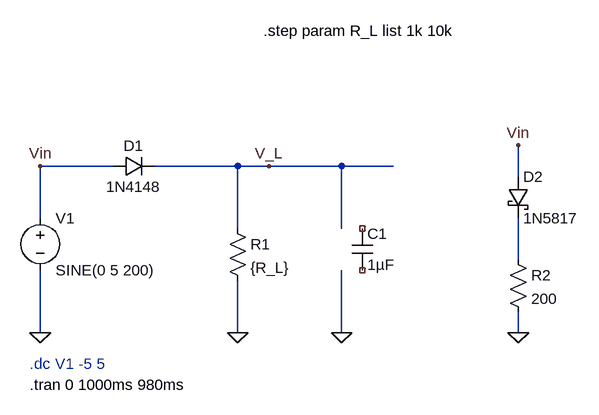
[diagram p0: schematic lab1part2.asc]
lab1part2.asc, the LTspice schematic file:
Version 4
SHEET 1 904 680
WIRE 176 48 64 48
WIRE 368 48 240 48
WIRE 416 48 368 48
WIRE 528 48 416 48
WIRE 608 48 528 48
WIRE 800 64 800 16
WIRE 64 128 64 48
WIRE 368 144 368 48
WIRE 528 144 528 48
WIRE 800 192 800 128
WIRE 64 304 64 208
WIRE 368 304 368 224
WIRE 528 304 528 208
WIRE 800 304 800 272
FLAG 64 304 0
FLAG 64 48 Vin
FLAG 368 304 0
FLAG 800 16 Vin
FLAG 800 304 0
FLAG 416 48 V_L
FLAG 528 304 0
SYMBOL voltage 64 112 R0
WINDOW 123 0 0 Left 0
WINDOW 39 0 0 Left 0
SYMATTR InstName V1
SYMATTR Value SINE(0 5 200)
SYMBOL res 352 128 R0
SYMATTR InstName R1
SYMATTR Value {R_L}
SYMBOL diode 176 64 R270
WINDOW 0 32 32 VTop 2
WINDOW 3 0 32 VBottom 2
SYMATTR InstName D1
SYMATTR Value 1N4148
SYMBOL res 784 176 R0
SYMATTR InstName R2
SYMATTR Value 200
SYMBOL schottky 784 64 R0
SYMATTR InstName D2
SYMATTR Value 1N5817
SYMATTR Description Diode
SYMATTR Type diode
SYMBOL cap 544 144 R0
SYMATTR InstName C1
SYMATTR Value 1µF
TEXT 48 352 Left 2 ;.dc V1 -5 5
TEXT 48 384 Left 2 !.tran 0 1000ms 980ms
TEXT 408 -160 Left 2 !.step param R_L list 1k 10k

The netlist it stands for:
* lab1part2.asc
V1 Vin 0 SINE(0 5 200)
R1 V_L 0 {R_L}
D1 Vin V_L 1N4148
R2 N001 0 200
D2 Vin N001 1N5817
C1 NC_01 NC_02 1µF
.model D D
.lib standard.dio
* .dc V1 -5 5
.tran 0 1000ms 980ms
.step param R_L list 1k 10k
.backanno
.end

* Results of the author's LTspice run, read from the files saved beside the schematic
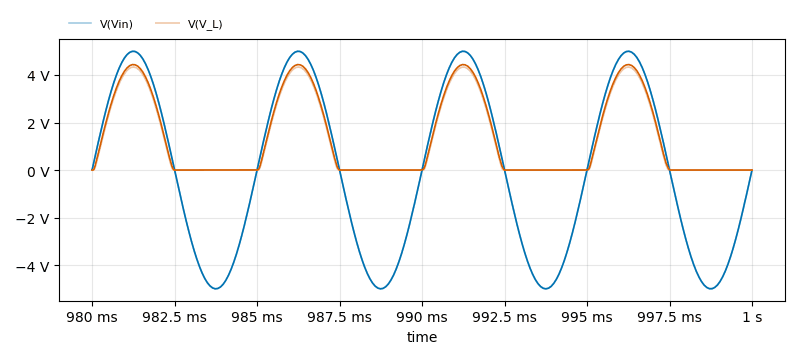
[diagram p1: Transient Analysis of lab1part2.asc, plotted from the saved traces]
* Transient Analysis, 2 runs:
*   V(Vin) [r_l=1000]: min -5 V, max 5 V, average 18.04 µV, rms 3.535 V, last 0 V
*   V(Vin) [r_l=10000]: min -5 V, max 4.998 V, average 15.66 µV, rms 3.535 V, last 0 V
*   V(V_L) [r_l=1000]: min -25.97 µV, max 4.334 V, average 1.289 V, rms 2.095 V, last 21.8 µV
*   V(V_L) [r_l=10000]: min -252.7 µV, max 4.438 V, average 1.339 V, rms 2.159 V, last 249.1 µV